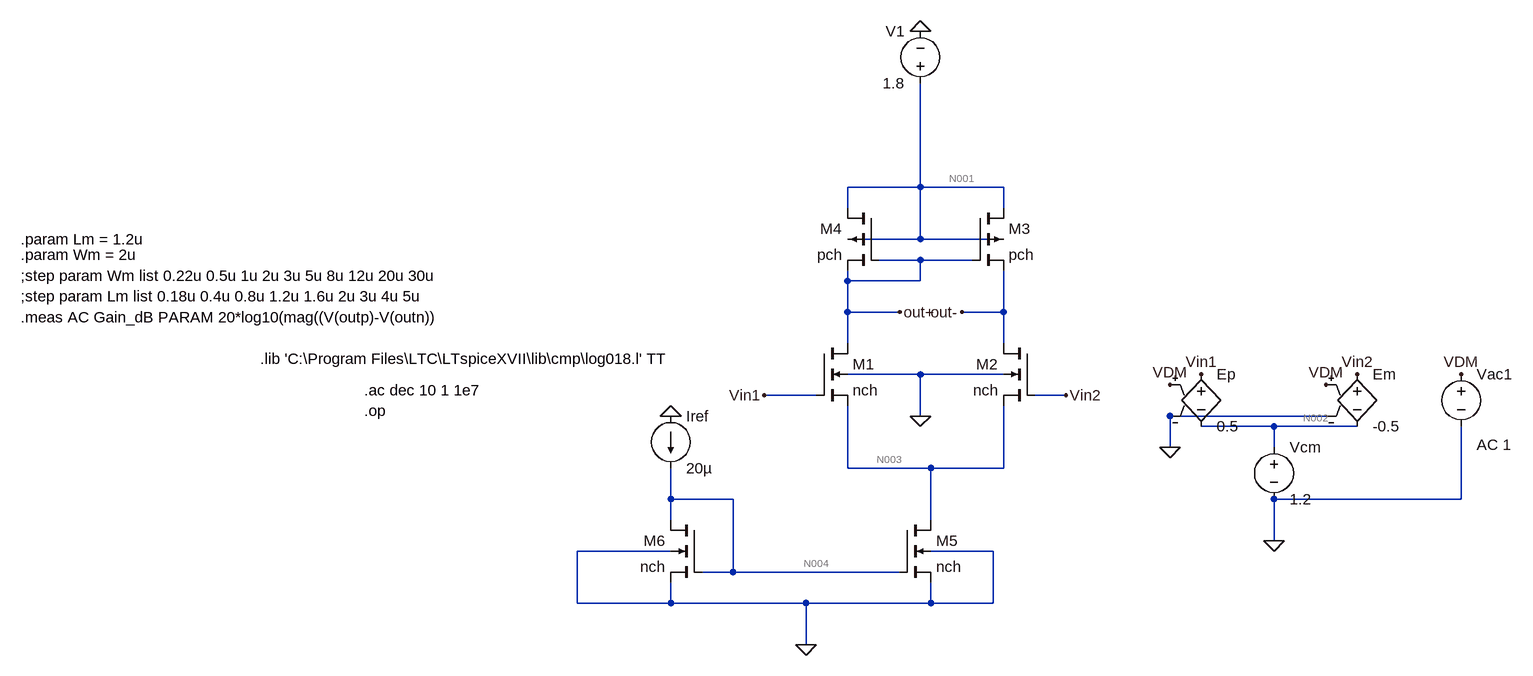
[diagram p0: schematic e4.asc]
e4.asc, the LTspice schematic file:
Version 4
SHEET 1 1180 692
WIRE 224 -32 224 -192
WIRE 224 -32 112 -32
WIRE 352 -32 224 -32
WIRE 112 0 112 -32
WIRE 352 0 352 -32
WIRE 224 48 224 -32
WIRE 224 48 112 48
WIRE 352 48 224 48
WIRE 224 80 160 80
WIRE 304 80 224 80
WIRE 112 112 112 96
WIRE 224 112 224 80
WIRE 224 112 112 112
WIRE 112 160 112 112
WIRE 192 160 112 160
WIRE 352 160 352 96
WIRE 352 160 288 160
WIRE 112 208 112 160
WIRE 352 208 352 160
WIRE 224 256 112 256
WIRE 352 256 224 256
WIRE 64 288 -16 288
WIRE 448 288 400 288
WIRE 224 320 224 256
WIRE 848 320 608 320
WIRE 768 336 656 336
WIRE 896 336 768 336
WIRE 608 368 608 320
WIRE 768 368 768 336
WIRE 112 400 112 304
WIRE 240 400 112 400
WIRE 352 400 352 304
WIRE 352 400 240 400
WIRE -160 448 -160 400
WIRE -64 448 -160 448
WIRE 1056 448 1056 336
WIRE 1056 448 768 448
WIRE -160 480 -160 448
WIRE 240 480 240 400
WIRE 768 512 768 448
WIRE -160 528 -304 528
WIRE 336 528 240 528
WIRE -64 560 -64 448
WIRE -64 560 -112 560
WIRE 192 560 -64 560
WIRE -304 608 -304 528
WIRE -160 608 -160 576
WIRE -160 608 -304 608
WIRE 48 608 -160 608
WIRE 240 608 240 576
WIRE 240 608 48 608
WIRE 336 608 336 528
WIRE 336 608 240 608
WIRE 48 672 48 608
FLAG 224 -272 0
FLAG -160 320 0
FLAG -16 288 Vin1
FLAG 448 288 Vin2
FLAG 768 512 0
FLAG 656 256 Vin1
FLAG 896 256 Vin2
FLAG 288 160 out-
FLAG 1056 256 VDM
FLAG 608 272 VDM
FLAG 848 272 VDM
FLAG 608 368 0
FLAG 224 320 0
FLAG 48 672 0
FLAG 192 160 out+
SYMBOL nmos4 64 208 R0
SYMATTR InstName M1
SYMATTR Value nch
SYMATTR Value2 l=Lm w=Wm
SYMBOL nmos4 400 208 M0
SYMATTR InstName M2
SYMATTR Value nch
SYMATTR Value2 l=Lm w=Wm
SYMBOL pmos4 304 0 R0
SYMATTR InstName M3
SYMATTR Value pch
SYMATTR Value2 l=0.5u w=2u
SYMBOL pmos4 160 0 M0
SYMATTR InstName M4
SYMATTR Value pch
SYMATTR Value2 l=0.5u w=2u
SYMBOL voltage 224 -176 R180
WINDOW 0 24 96 Left 2
WINDOW 3 24 16 Left 2
WINDOW 123 0 0 Left 0
WINDOW 39 0 0 Left 0
SYMATTR InstName V1
SYMATTR Value 1.8
SYMBOL nmos4 192 480 R0
SYMATTR InstName M5
SYMATTR Value nch
SYMATTR Value2 l=5u w=30u
SYMBOL nmos4 -112 480 M0
SYMATTR InstName M6
SYMATTR Value nch
SYMATTR Value2 l=5u w=15u
SYMBOL current -160 320 R0
WINDOW 123 0 0 Left 0
WINDOW 39 0 0 Left 0
SYMATTR InstName Iref
SYMATTR Value 20µ
SYMBOL voltage 768 352 R0
WINDOW 123 0 0 Left 0
WINDOW 39 0 0 Left 0
SYMATTR InstName Vcm
SYMATTR Value 1.2
SYMBOL e 656 240 R0
SYMATTR InstName Ep
SYMATTR Value 0.5
SYMBOL e 896 240 R0
SYMATTR InstName Em
SYMATTR Value -0.5
SYMBOL voltage 1056 240 R0
WINDOW 3 24 152 Left 2
WINDOW 123 24 124 Left 2
WINDOW 39 0 0 Left 0
SYMATTR Value ""
SYMATTR Value2 AC 1
SYMATTR InstName Vac1
TEXT -632 280 Left 2 !.ac dec 10 1 1e7
TEXT -632 312 Left 2 !.op
TEXT -792 232 Left 2 !.lib 'C:\\Program Files\\LTC\\LTspiceXVII\\lib\\cmp\\log018.l' TT
TEXT -1160 136 Left 2 !;step param Lm list 0.18u 0.4u 0.8u 1.2u 1.6u 2u 3u 4u 5u
TEXT -1160 104 Left 2 !;step param Wm list 0.22u 0.5u 1u 2u 3u 5u 8u 12u 20u 30u
TEXT -1160 168 Left 2 !.meas AC Gain_dB PARAM 20*log10(mag((V(outp)-V(outn))
TEXT -1160 72 Left 2 !.param Wm = 2u
TEXT -1160 48 Left 2 !.param Lm = 1.2u

The netlist it stands for:
* e4.asc
M1 out+ Vin1 N003 0 nch l=Lm w=Wm
M2 out- Vin2 N003 0 nch l=Lm w=Wm
M3 N001 out+ out- N001 pch l=0.5u w=2u
M4 N001 out+ out+ N001 pch l=0.5u w=2u
V1 N001 0 1.8
M5 N003 N004 0 0 nch l=5u w=30u
M6 N004 N004 0 0 nch l=5u w=15u
Iref 0 N004 20µ
Vcm N002 0 1.2
Ep Vin1 N002 VDM 0 0.5
Em Vin2 N002 VDM 0 -0.5
Vac1 VDM 0 AC 1
.model NMOS NMOS
.model PMOS PMOS
.lib standard.mos
.ac dec 10 1 1e7
.op
.lib 'C:\Program Files\LTC\LTspiceXVII\lib\cmp\log018.l' TT
;step param Lm list 0.18u 0.4u 0.8u 1.2u 1.6u 2u 3u 4u 5u
;step param Wm list 0.22u 0.5u 1u 2u 3u 5u 8u 12u 20u 30u
.meas AC Gain_dB PARAM 20*log10(mag((V(outp)-V(outn))
.param Wm = 2u
.param Lm = 1.2u
.backanno
.end

* Results of the author's LTspice run, read from the files saved beside the schematic
* Operating Point, zero values left out:
*   V(out+) = 915.1 mV
*   V(vin1) = 1.2 V
*   V(n003) = 379.4 mV
*   V(out-) = 915.1 mV
*   V(vin2) = 1.2 V
*   V(n001) = 1.8 V
*   V(n004) = 615.3 mV
*   V(n002) = 1.2 V
*   Id(M6) = 20 µA
*   Is(M6) = -20 µA
*   Id(M5) = 39.79 µA
*   Is(M5) = -39.79 µA
*   Id(M4) = 19.9 µA
*   Is(M4) = -19.9 µA
*   Id(M3) = 19.9 µA
*   Is(M3) = -19.9 µA
*   Id(M2) = 19.9 µA
*   Ib(M2) = -1.314 pA
*   Is(M2) = -19.9 µA
*   Id(M1) = 19.9 µA
*   Ib(M1) = -1.314 pA
*   Is(M1) = -19.9 µA
*   I(Iref) = 20 µA
*   I(V1) = -39.79 µA
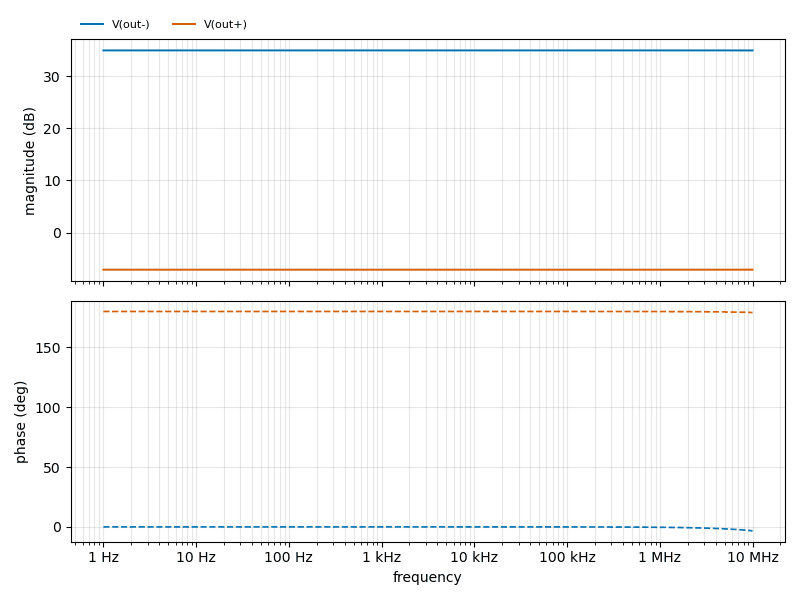
[diagram p1: AC Analysis of e4.asc, plotted from the saved traces]
* AC Analysis, 1 run:
*   V(out-): 34.90 dB at 1 Hz, 34.89 dB at 10 MHz, peak 34.90 dB at 1 Hz
*   V(out+): -7.09 dB at 1 Hz, -7.07 dB at 10 MHz, peak -7.07 dB at 10 MHz
* From the log:
*   Semiconductor Device Operating Points:
*                           --- BSIM3 MOSFETS ---
*   Name:        m6          m5          m4          m3          m2
*   Model:      nch.1       nch.1       pch.5       pch.5       nch.4
*   Id:        2.00e-05    3.98e-05    1.99e-05    1.99e-05    1.99e-05
*   Vgs:       6.15e-01    6.15e-01    0.00e+00   -1.55e-15    8.21e-01
*   Vds:       6.15e-01    3.79e-01    8.85e-01    8.85e-01    5.36e-01
*   Vbs:       0.00e+00    0.00e+00    8.85e-01    8.85e-01   -3.79e-01
*   Vth:       4.45e-01    4.48e-01   -4.61e-01   -4.61e-01    5.81e-01
*   Vdsat:     2.07e-01    2.06e-01   -3.57e-01   -3.57e-01    2.70e-01
*   Gm:        1.90e-04    3.81e-04    8.22e-05    8.22e-05    1.39e-04
*   Gds:       3.02e-07    1.78e-06    1.31e-06    1.31e-06    1.17e-06
*   Gmb        5.50e-05    1.11e-04    2.83e-05    2.83e-05    3.42e-05
*   Cbd:       0.00e+00    0.00e+00    0.00e+00    0.00e+00    0.00e+00
*   Cbs:       0.00e+00    0.00e+00    0.00e+00    0.00e+00    0.00e+00
*   Cgsov:     5.49e-15    1.10e-14    6.46e-16    6.46e-16    7.26e-16
*   Cgdov:     5.49e-15    1.10e-14    6.46e-16    6.46e-16    7.26e-16
*   Cgbov:     9.11e-16    9.11e-16    1.36e-16    1.36e-16    2.18e-16
*   dQgdVgb:   4.27e-13    8.52e-13    7.92e-15    7.92e-15    1.54e-14
*   dQgdVdb:  -5.71e-15   -1.40e-14   -6.48e-16   -6.48e-16   -7.50e-16
*   dQgdVsb:  -3.76e-13   -7.48e-13   -6.86e-15   -6.86e-15   -1.34e-14
*   dQddVgb:  -6.68e-15   -2.00e-14   -6.57e-16   -6.57e-16   -8.05e-16
*   dQddVdb:   5.99e-15    1.64e-14    6.54e-16    6.54e-16    7.75e-16
*   dQddVsb:   1.03e-15    6.22e-15    6.85e-18    6.85e-18    4.95e-17
*   dQbdVgb:  -3.32e-14   -6.14e-14   -1.29e-15   -1.29e-15   -1.47e-15
*   dQbdVdb:  -2.85e-17   -4.61e-16   -1.87e-18   -1.87e-18   -5.79e-18
*   dQbdVsb:  -1.22e-13   -2.49e-13   -8.84e-16   -8.84e-16   -2.85e-15
*   Name:        m1
*   Model:      nch.4
*   Id:        1.99e-05
*   Vgs:       8.21e-01
*   Vds:       5.36e-01
*   Vbs:      -3.79e-01
*   Vth:       5.81e-01
*   Vdsat:     2.70e-01
*   Gm:        1.39e-04
*   Gds:       1.17e-06
*   Gmb        3.42e-05
*   Cbd:       0.00e+00
*   Cbs:       0.00e+00
*   Cgsov:     7.26e-16
*   Cgdov:     7.26e-16
*   Cgbov:     2.18e-16
*   dQgdVgb:   1.54e-14
*   dQgdVdb:  -7.50e-16
*   dQgdVsb:  -1.34e-14
*   dQddVgb:  -8.05e-16
*   dQddVdb:   7.75e-16
*   dQddVsb:   4.95e-17
*   dQbdVgb:  -1.47e-15
*   dQbdVdb:  -5.79e-18
*   dQbdVsb:  -2.85e-15
*   Measurement "gain_db" FAIL'ed